# EAGLE design LAMP (EAGLE 9.6.2)
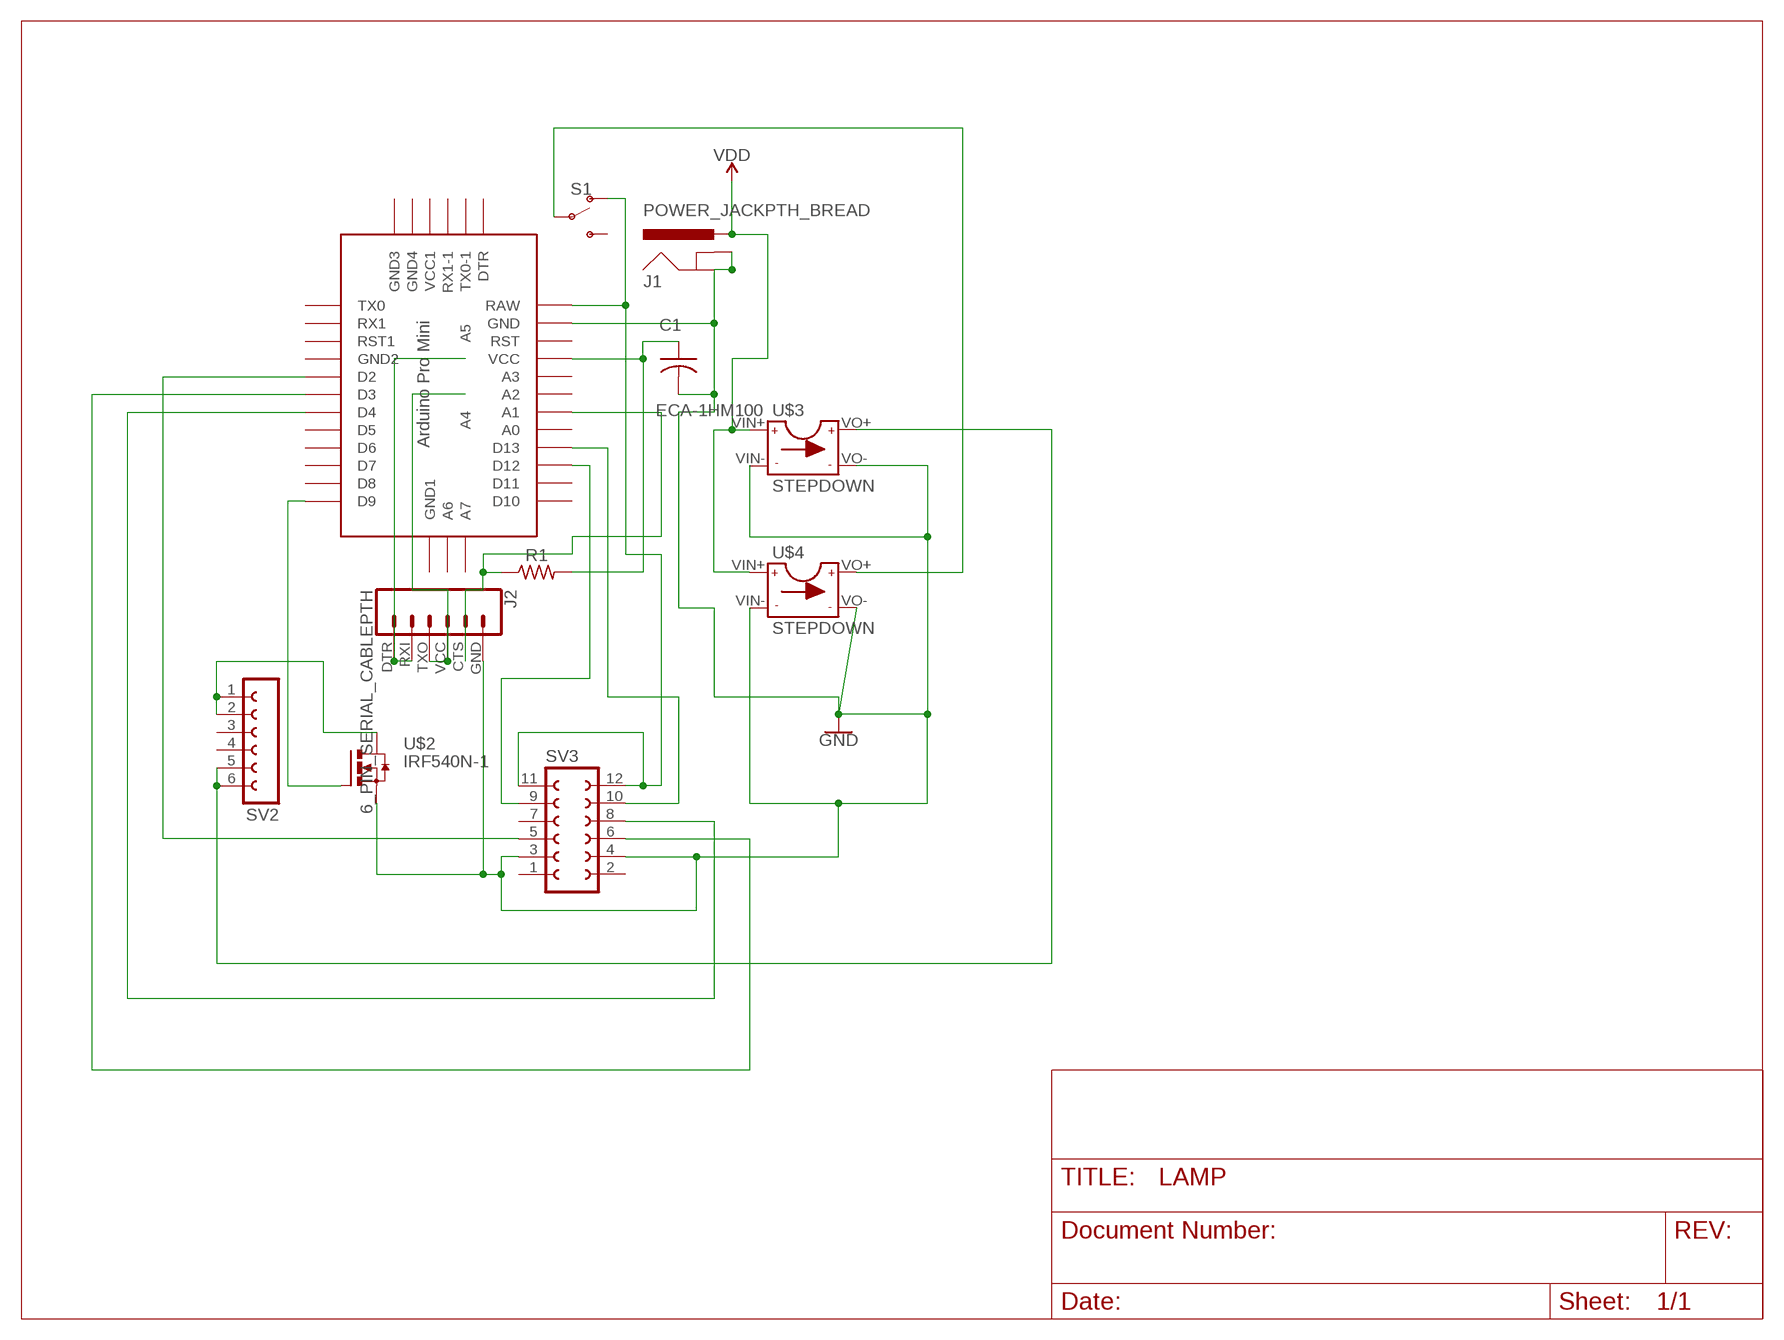
[diagram p0: schematic, sheet 1]

## Parts
C1  ECA-1HM100  [CAP_RADIAL_2MM]
J1  POWER_JACKPTH_BREAD  [POWER_JACK_PTH_BREAD]
J2  6_PIN_SERIAL_CABLEPTH  [FTDI_BASIC]
R1  1k  R-US_V234/12  [V234/12]
S1  SWITCH-SPDT-PTH-11.6X4.0MM  [SWITCH_SPDT_PTH_11.6X4.0MM]
SV2  FE06-1  [FE06]
SV3  FE06-2  [FE06-2]
U$1  ABK-PRO-MINI-2  [ABK-PRO-MINI-2]
U$2  IRF540N-1  [1X03]
U$3  STEPDOWN  [STEPDOWN-1]
U$4  STEPDOWN  [STEPDOWN-1]

## Nets
GND: C1.2 J1.GND J1.GNDBREAK J2.GND SV3.3 SV3.4 U$1.GND U$2.3(S) U$3.VIN- U$3.VO- U$4.VIN- U$4.VO-
N$1: S1.2(P) U$4.VO+
N$2: S1.1(O) SV3.11 SV3.12 U$1.RAW
N$4: SV2.1 SV2.2 U$2.2(D)
N$5: J2.DTR J2.RXI U$1.A5
N$6: U$1.D9 U$2.1(G)
N$7: SV3.9 U$1.D12
N$8: SV2.5 SV2.6 U$3.VO+
N$9: SV3.10 U$1.D13
N$10: J2.CTS R1.1 U$1.A1
N$11: C1.1 R1.2 U$1.VCC
N$12: SV3.5 U$1.D2
N$13: SV3.6 U$1.D3
N$14: SV3.8 U$1.D4
N$15: J2.TXO J2.VCC U$1.A4
VDD: J1.PWR U$3.VIN+ U$4.VIN+
Unconnected: S1.3(S) SV2.3 SV2.4 SV3.1 SV3.2 SV3.7 U$1.A0 U$1.A2 U$1.A3 U$1.A6 U$1.A7 U$1.D5 U$1.D6 U$1.D7 U$1.D8 U$1.D10 U$1.D11 U$1.DTR U$1.GND1 U$1.GND2 U$1.GND3 U$1.GND4 U$1.RST U$1.RST1 U$1.RX1 U$1.RX1-1 U$1.TX0 U$1.TX0-1 U$1.VCC1

## Library data of the parts
C1 = Resistor_Capacitor:ECA-1HM100: CAP ALUM 10UF 20% 50V RADIAL Manufacturer's datasheet <https://media.digikey.com/pdf/Data%20Sheets/Panasonic%20Electronic%20Components/ECA-xxM%20Series,TypeA.pdf>; CREATED_BY: PCBLayout.com; DIGIKEY_PART_NUMBER: P5178-ND; MANUFACTURER: Panasonic Electronic Components; MPN: ECA-1HM100; PACKAGE: CAP RADIAL 2MM LS
J1 = SparkFun-Connectors:POWER_JACK: Power Jack Connector This is the standard 5.5mm barrel jack for power. The PTH is the most common, proven, reliable, footprint. The Slot footprint only works if the mill layer is transmitted to the PCB fab house so be warned. Here are the connectors we sell at SparkFun: DC Barrel Power Jack/Connector <https://www.sparkfun.com/products/119> (PRT-00119) DC Barrel Power Jack/Connector (SMD) <https://www.sparkfun.com/products/12748> (PRT-12748) DC Barrel Jack Adapter - Breadboard Compatible <https://www.sparkfun.com/products/10811> (PRT-10811) It is used on this SparkFun product (and many, many others): SparkFun RedBoard - Programmed with Arduino <https://www.sparkfun.com/products/12757> (DEV-12757) Also, if you need a mating power supply or connector, please check these out: Wall Adapter Power Supply - 9VDC 650mA <https://www.sparkfun.com/products/298> (TOL-00298) DC Barrel Jack Adapter - Male <https://www.sparkfun.com/products/10287> (PRT-10287); PROD_ID: COMP-13253
J2 = SparkFun-Connectors:6_PIN_SERIAL_CABLE: 6-pin header connection for use with the "FTDI BASIC" pinout - CABLE SIDE. Also known as "Arduino Serial Program Header". This is used on a design to provide a 6-pin connection point for serial communication usually from a USB cable (D+/D-) to these headers (RX/TX). It also has the remaining pins necessary for programming in the Arduino evironment (DTR, GND, and sometimes VCC). Note, this device has "CABLE" in the name. It is intended to be used on a design that usually lives on the end of your USB cable and prvides the converter chip (FTDI232 or FTDI231x) to commnicate serial RX/TX. The "sister" device, named "TARGET" is inteneded to be used on a design that contains a target micro-controller that you wish to program. You can populate with some of these: Female Headers <https://www.sparkfun.com/products/115> (PRT-00115) For reference (or to suit your programming needs) check out these designs: SparkFun FTDI Basic Breakout - 5V <https://www.sparkfun.com/products/9716> (DEV-09716) SparkFun FTDI Basic Breakout - 3.3V <https://www.sparkfun.com/products/9873> (DEV-09873) SparkFun FTDI SmartBasic <https://www.sparkfun.com/products/12935> (DEV-12935) SparkFun Beefy 3 - FTDI Basic Breakout <https://www.sparkfun.com/products/13746> (DEV-13746)
R1 = rcl:R-US_: RESISTOR, American symbol; SPICEPREFIX: R
S1 = SparkFun-Switches:SWITCH-SPDT: Single Pole, Double Throw (SPDT) Switch Single-pole, double-throw (SPDT) switch. Variant Overview SMD-AYZ0202 Surface Mount DPDT Switch <https://www.sparkfun.com/products/597> (COM-00597) Used on e.g. LilyPad Arduino USB - ATmega32U4 Board <https://www.sparkfun.com/products/12049> PTH-11.6X4.0MM SPDT Mini Power Switch <https://www.sparkfun.com/products/102> (COM-00102) Used on e.g. SparkFun Simon Says - Through-Hole Soldering Kit <https://www.sparkfun.com/products/10547> (KIT-10547) PTH-11.6X4.0MM-KIT KIT version of SPDT Mini Power Switch - Simplifies soldering by removing tStop of switch pins - only one side can be soldered. PTH-11.6X4.0MM-LOCK LOCK version of SPDT Mini Power Switch - Offset pins hold switch in place for easier soldering. SMD-RIGHT-ANGLE Surface Mount Right Angle Switch <https://www.sparkfun.com/products/10860> (COM-10860) Used on e.g. SparkFun ESP8266 Thing <https://www.sparkfun.com/products/13231>; PROD_ID: SWCH-08261; SF_SKU: COM-00102
SV2 = con-lsta:FE06-1: FEMALE HEADER; OC_FARNELL: unknown; OC_NEWARK: unknown
SV3 = con-lsta:FE06-2: FEMALE HEADER; OC_FARNELL: unknown; OC_NEWARK: unknown
U$1 = Arduino-clone:ABK-PRO-MINI-2: ABK Pro-Mini Arduino Clone
U$2 = IRF540N:IRF540N-1: IRF540N N-Channel MOSFET; T1: IRF540N
U$3 U$4 = Custom:STEPDOWN

## Board
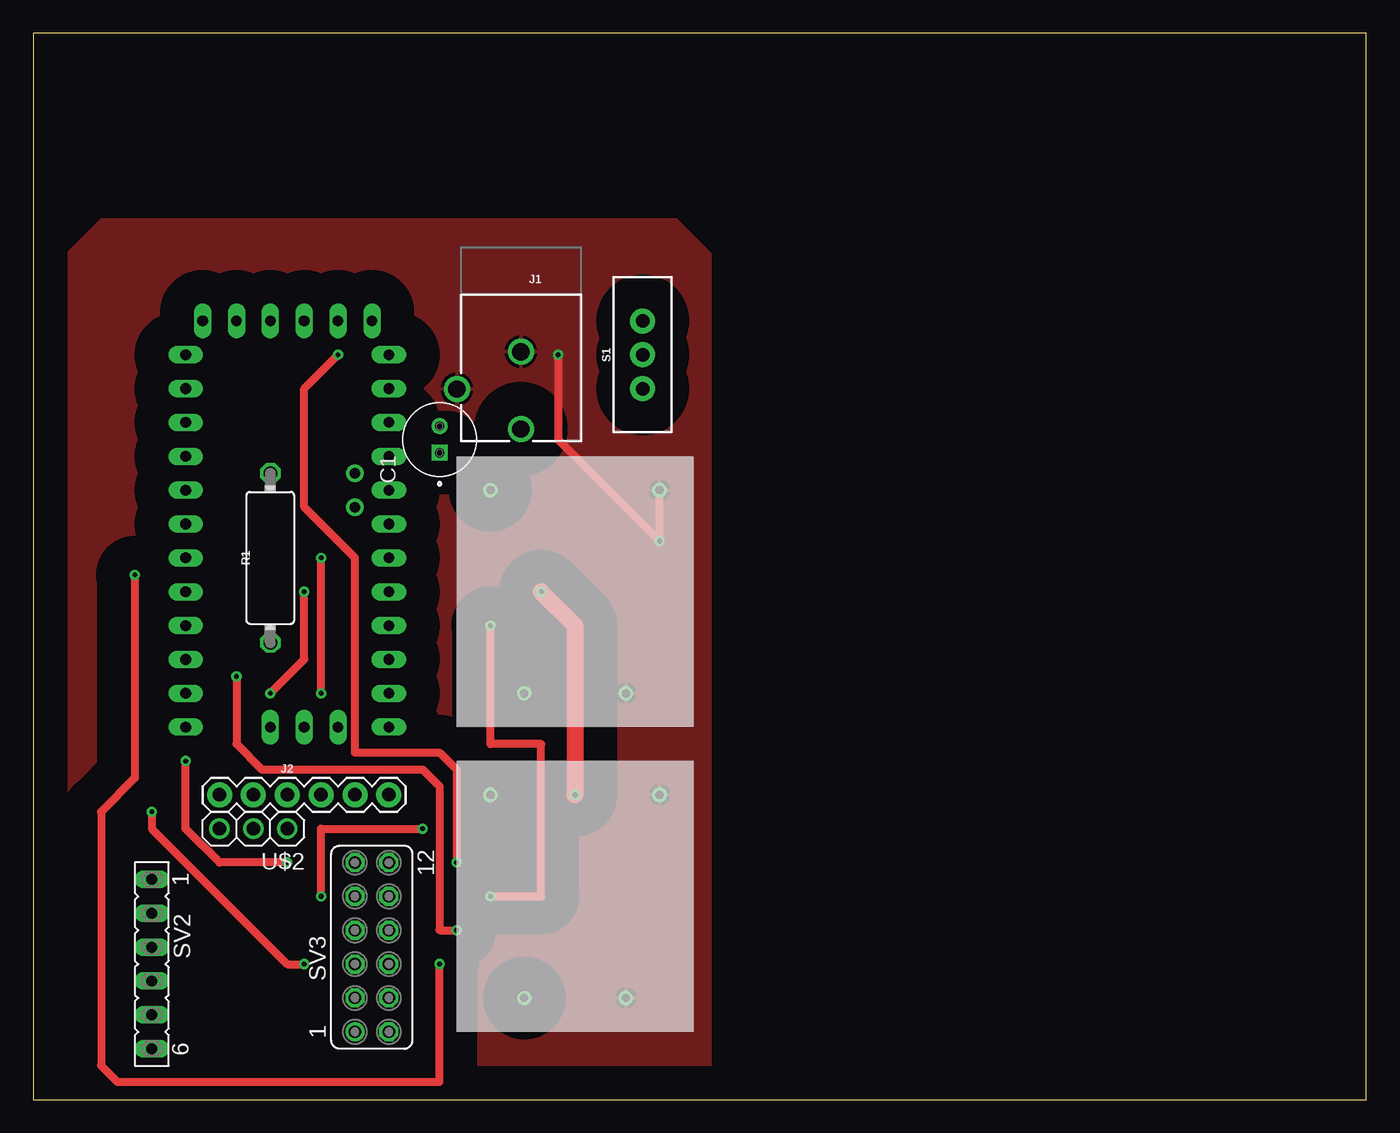
[diagram p1: board, top side]
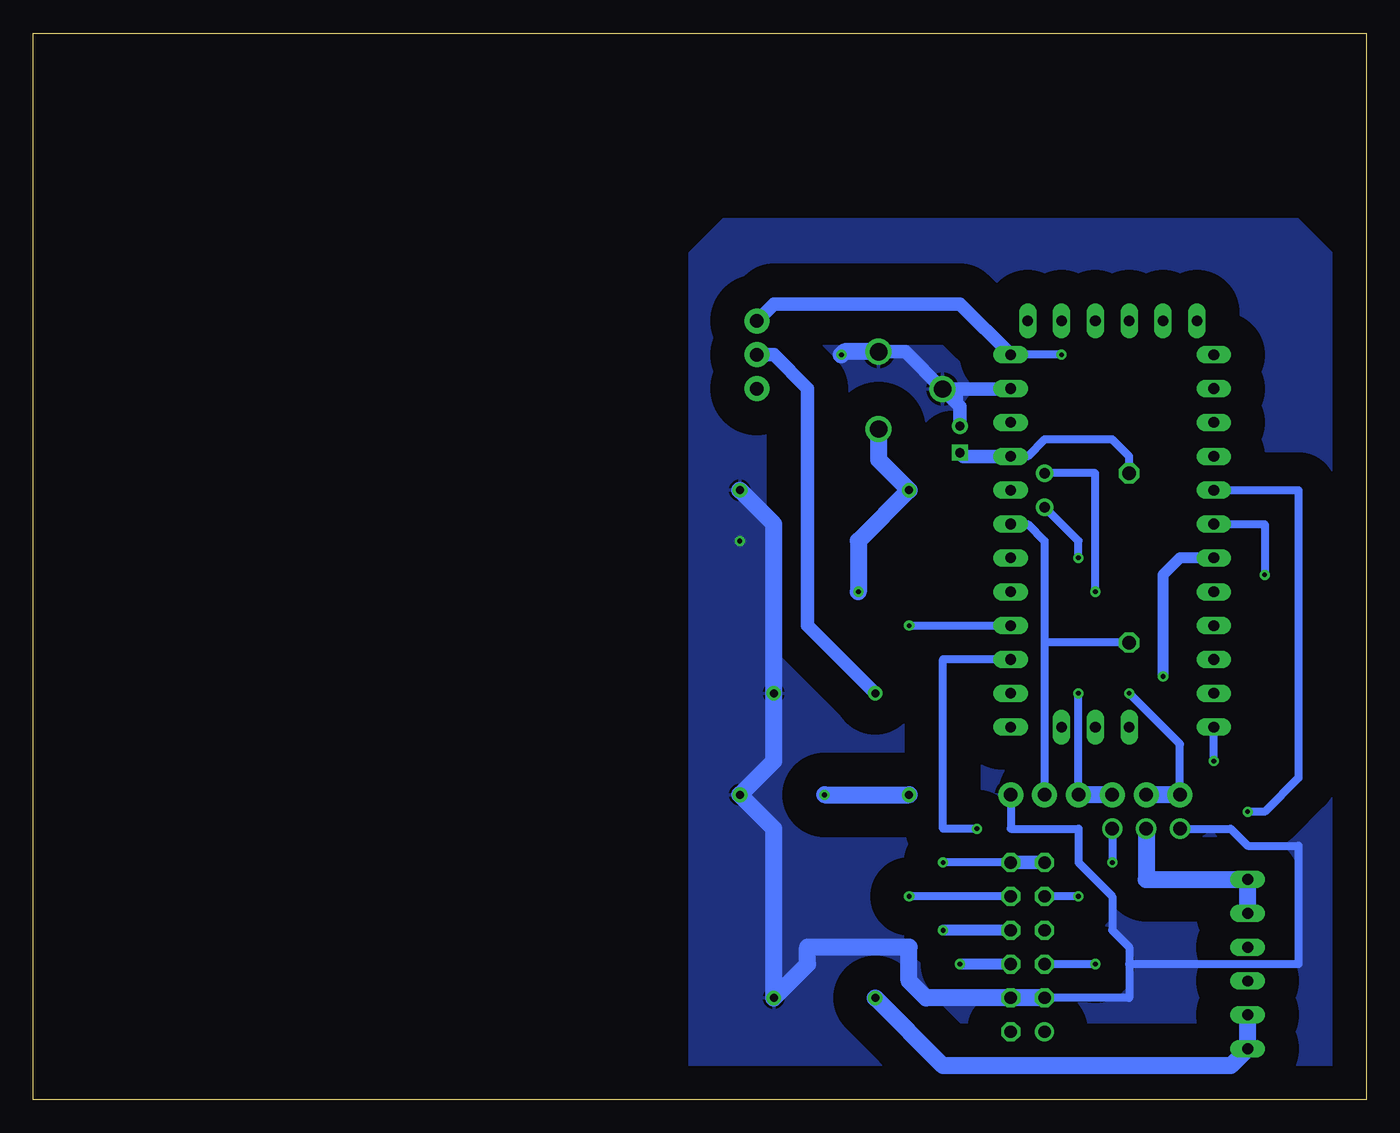
[diagram p2: board, bottom side, seen from below]

Size 100 x 80 mm. Coordinates in mm from the lower left corner, seen from the top.
Outline: 0,0 100,0 100,80 0,80 0,0
Copper layers (1*16): Top 0.035mm / dielectric 1.5mm / Bottom 0.035mm
Design rules "default": minimum track width 6mil, minimum drill 0.35mm, track to track 6mil, track to pad 6mil, pad to pad 6mil, via to via 6mil, smd to smd 6mil, copper to edge 40mil, drill to drill 6mil, minimum pad ring 10mil, minimum via ring 8mil, stop-mask expansion 4mil, vias tented up to drill 0mil, thermal gap 10mil

### Footprints (pad centres in the part's own frame; a part is rotated, then mirrored left to right if it is on the bottom)
CAP_RADIAL_2MM = drill 0.7 pad 1.1 square: 1 -1,0 | drill 0.7 pad 1.1: 2 1,0
POWER_JACK_PTH_BREAD = drill 1.3: GND 0,7.9; GNDBREAK 4.8,10.7; PWR 0,13.7
FTDI_BASIC = drill 1.016 pad 1.88: CTS 10.16,0; DTR 0,0; GND 12.7,0; RXI 2.54,0; TXO 5.08,0; VCC 7.62,0
V234/12 = drill 1.016 octagon: 1 -6.35,0; 2 6.35,0
SWITCH_SPDT_PTH_11.6X4.0MM = drill 1.016 pad 1.88: 1 0,2.54; 2 0,0; 3 0,-2.54
FE06 = drill 0.813 long: 1 -6.35,0; 2 -3.81,0; 3 -1.27,0; 4 1.27,0; 5 3.81,0; 6 6.35,0
FE06-2 = drill 0.914: 1 -6.35,1.27 | drill 0.914 octagon: 2 -6.35,-1.27; 3 -3.81,1.27; 4 -3.81,-1.27; 5 -1.27,1.27; 6 -1.27,-1.27; 7 1.27,1.27; 8 1.27,-1.27; 9 3.81,1.27; 10 3.81,-1.27; 11 6.35,1.27; 12 6.35,-1.27
ABK-PRO-MINI-2 = drill 0.8 long: A0 10.16,-3.81; A1 10.16,-6.35; A2 10.16,-8.89; A3 10.16,-11.43; A6 3.81,-21.59; A7 6.35,-21.59; D2 -5.08,-3.81; D3 -5.08,-6.35; D4 -5.08,-8.89; D5 -5.08,-11.43; D6 -5.08,-13.97; D7 -5.08,-16.51; D8 -5.08,-19.05; D9 -5.08,-21.59; D10 10.16,-21.59; D11 10.16,-19.05; D12 10.16,-16.51; D13 10.16,-13.97; DTR 8.89,8.89; GND 10.16,3.81; GND1 -5.08,-1.27; GND2 -3.81,8.89; GND3 -1.27,8.89; GND4 1.27,-21.59; RAW 10.16,6.35; RST 10.16,1.27; RST1 -5.08,1.27; RX1 -5.08,3.81; RX1-1 3.81,8.89; TX0 -5.08,6.35; TX0-1 6.35,8.89; VCC 10.16,-1.27; VCC1 1.27,8.89 | drill 0.8: A4 7.62,-5.08; A5 7.62,-2.54
1X03 = drill 1.016: 1 -2.54,0; 2 0,0; 3 2.54,0
STEPDOWN-1 = drill 0.6: VIN+ -7.62,10.16; VIN- 5.08,10.16; VO+ -5.08,-5.08; VO- 2.54,-5.08

### Placement (x,y rotation side)
C1  30.48,49.53 90 top
J1  36.58,64.01 180 top
J2  13.97,22.86 0 top
R1  17.78,40.64 90 top
S1  45.72,55.88 0 top
SV2  8.89,10.16 270 top
SV3  25.4,11.43 90 top
U$1  16.51,49.53 0 top
U$2  16.51,20.32 180 top
U$3  41.91,12.7 0 top
U$4  41.91,35.56 0 top

### Tracks (layer width: path | path; a pad name or v marks a point on that pad's centre or on a via)
GND  (via drill 0.35)
  Top 0.61: v39.37,55.88 39.37,49.53 v46.99,41.91 U$4.VIN-
  Bottom 0.508: U$1.GND 30.48,53.34 | 30.48,53.34 31.74,53.34 J1.GNDBREAK | C1.2 30.48,50.8 30.48,53.34
  Bottom 0.61: J2.GND 26.67,20.32 21.59,20.32 21.59,17.78 19.05,15.24 19.05,12.7 17.78,11.43 17.78,10.16 | 17.78,10.16 17.78,7.62 SV3.3 | 17.78,10.16 5.08,10.16 5.08,19.05 8.89,19.05 10.16,20.32 U$2.3
  Bottom 1.016: J1.GNDBREAK 34.58,56.11 J1.GND | J1.GNDBREAK 26.7,53.31 U$1.GND | J1.GNDBREAK 30.48,52.01 30.48,50.8
  Bottom 1.27: J1.GND 39.14,56.11 v39.37,55.88 | SV3.3 SV3.4 33.02,7.62 34.29,8.89 34.29,11.43 41.91,11.43 41.91,10.16 U$3.VO- 44.45,20.32 U$3.VIN- 44.45,25.4 U$4.VO- 44.45,43.18 U$4.VIN-
  pour Top (isolate 2.54): 7.62,66.04 48.26,66.04 50.8,63.5 50.8,2.54 48.26,0 5.08,0 2.54,2.54 2.54,63.5 5.08,66.04
  pour Bottom (isolate 2.54): 2.54,63.5 5.08,66.04 48.26,66.04 50.8,63.5 50.8,2.54 48.26,0 5.08,0 2.54,2.54
N$1
  Bottom 1.016: U$4.VO+ 41.91,35.56 41.91,53.34 44.45,55.88 S1.2
N$2  (via drill 0.35)
  Top 0.61: v31.75,17.78 31.75,24.77 30.48,26.04 24.13,26.04 24.13,40.64 20.32,44.45 20.32,53.34 v22.86,55.88
  Bottom 0.61: SV3.12 v31.75,17.78 | v22.86,55.88 U$1.RAW
  Bottom 1.016: U$1.RAW 30.48,59.69 44.45,59.69 S1.1 | SV3.11 SV3.12
N$4
  Bottom 1.27: SV2.2 SV2.1 16.51,16.51 U$2.2
N$5  (via drill 0.35)
  Top 0.61: v20.32,38.1 20.32,33.02 v17.78,30.48
  Bottom 0.61: J2.DTR 13.97,26.67 v17.78,30.48 | v20.32,38.1 20.32,46.99 U$1.A5
  Bottom 1.27: J2.DTR J2.RXI
N$6  (via drill 0.35)
  Top 0.61: v19.05,17.78 13.97,17.78 11.43,20.32 v11.43,25.4
  Bottom 0.61: U$2.1 v19.05,17.78 | v11.43,25.4 U$1.D9
N$7  (via drill 0.35)
  Top 0.61: v21.59,15.24 21.59,20.32 v29.21,20.32
  Bottom 0.61: U$1.D12 31.75,33.02 31.75,20.32 v29.21,20.32 | v21.59,15.24 SV3.9
N$8
  Bottom 1.27: SV2.5 SV2.6 10.16,2.54 31.75,2.54 U$3.VO+
N$9  (via drill 0.35)
  Top 0.61: v34.29,15.24 38.1,15.24 38.1,26.67 34.29,26.67 v34.29,35.56
  Bottom 0.61: SV3.10 v34.29,15.24 | v34.29,35.56 U$1.D13
N$10
  Bottom 0.61: 24.13,34.29 J2.CTS | U$1.A1 25.4,43.18 24.13,41.91 24.13,34.29 | R1.1 24.13,34.29
N$11
  Bottom 0.61: R1.2 17.78,48.26 19.05,49.53 24.13,49.53 25.4,48.26 U$1.VCC
  Bottom 1.016: C1.1 30.21,48.26 U$1.VCC
N$12  (via drill 0.35)
  Top 0.61: v8.89,21.59 8.89,20.32 19.05,10.16 v20.32,10.16
  Bottom 0.61: U$1.D2 5.08,45.72 5.08,24.13 7.62,21.59 v8.89,21.59 | v20.32,10.16 SV3.5
N$13  (via drill 0.35)
  Top 0.61: v7.62,39.37 7.62,24.13 5.08,21.59 5.08,2.54 6.3,1.32 30.48,1.32 v30.48,10.16
  Bottom 0.61: U$1.D3 7.62,43.18 v7.62,39.37
  Bottom 0.813: SV3.6 v30.48,10.16
N$14  (via drill 0.35)
  Top 0.61: v15.24,31.75 15.24,26.67 17.14,24.77 29.21,24.77 30.48,23.5 30.48,12.7 v31.75,12.7
  Bottom 0.813: SV3.8 v31.75,12.7 | U$1.D4 13.97,40.64 15.24,39.37 v15.24,31.75
N$15  (via drill 0.35)
  Top 0.61: v21.59,30.48 v21.59,40.64
  Bottom 0.61: J2.VCC v21.59,30.48 | v21.59,40.64 21.59,41.91 U$1.A4
  Bottom 1.27: J2.TXO J2.VCC
VDD  (via drill 0.35)
  Top 1.27: v38.1,38.1 40.64,35.56 v40.64,22.86
  Bottom 1.27: J1.PWR 36.58,48.01 U$4.VIN+ 38.1,41.91 v38.1,38.1 | v40.64,22.86 U$3.VIN+